# Altium schematic sheet theremin.SchDoc
size Letter
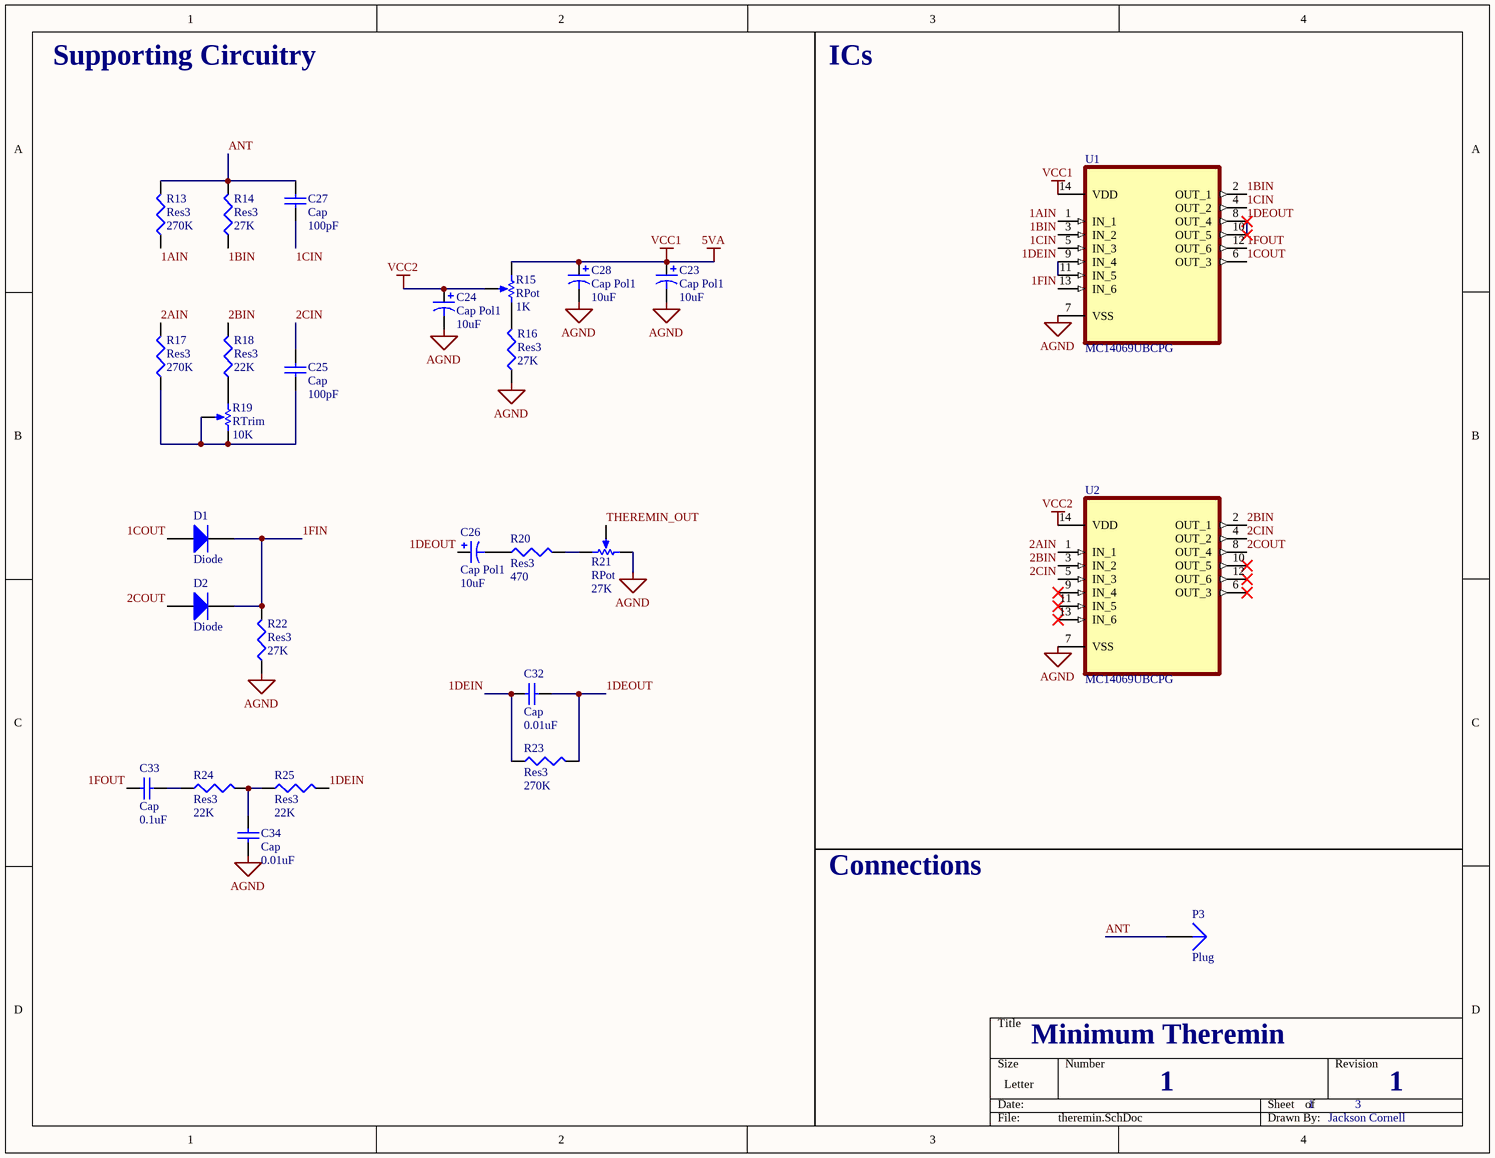
[diagram p0: theremin.SchDoc]

## Parts
C23  Cap Pol1  value 10uF  [CAPC0805]
C24  Cap Pol1  value 10uF  [CAPC0805]
C25  Cap  value 100pF  [CAPC0805]
C26  Cap Pol1  value 10uF  [CAPC0805]
C27  Cap  value 100pF  [CAPC0805]
C28  Cap Pol1  value 10uF  [CAPC0805]
C32  Cap  value 0.01uF  [CAPC0805]
C33  Cap  value 0.1uF  [CAPC0805]
C34  Cap  value 0.01uF  [CAPC0805]
D1  Diode  [SMC]
D2  Diode  [SMC]
P3  Plug  [PIN1]
R13  Res3  value 270K  [RES0805]
R14  Res3  value 27K  [RES0805]
R15  RPot  value 1K  [HDR1X3]
R16  Res3  value 27K  [RES0805]
R17  Res3  value 270K  [RES0805]
R18  Res3  value 22K  [RES0805]
R19  RTrim  value 10K  [VR5]
R20  Res3  value 470  [RES0805]
R21  RPot  value 27K  [HDR1X3]
R22  Res3  value 27K  [RES0805]
R23  Res3  value 270K  [RES0805]
R24  Res3  value 22K  [RES0805]
R25  Res3  value 22K  [RES0805]
U1  MC14069UBCPG  [DIP254P762X469-14]
U2  MC14069UBCPG  [DIP254P762X469-14]

## Nets
5VA: C23.1 C28.1 R15.1(TOP) U1.14(VDD)  [also labelled VCC1]
AGND: C23.2 C24.2 C28.2 C34.1 R16.1 R21.1(TOP) R22.1 U1.7(VSS) U2.7(VSS)
VCC2: C24.1 R15.3(TAP) U2.14(VDD)
1AIN: R13.1 U1.1(IN_1)
1BIN: R14.1 U1.2(OUT_1) U1.3(IN_2)
1CIN: C27.1 U1.4(OUT_2) U1.5(IN_3)
1COUT: D1.1(A) U1.6(OUT_3)
1DEIN: C32.1 R23.1 R25.2 U1.9(IN_4) U1.11(IN_5)
1DEOUT: C26.1 C32.2 R23.2 U1.8(OUT_4) U1.10(OUT_5)
1FIN: D1.2(K) D2.2(K) R22.2 U1.13(IN_6)
1FOUT: C33.1 U1.12(OUT_6)
2AIN: R17.2 U2.1(IN_1)
2BIN: R18.2 U2.2(OUT_1) U2.3(IN_2)
2CIN: C25.2 U2.4(OUT_2) U2.5(IN_3)
2COUT: D2.1(A) U2.8(OUT_4)
ANT: C27.2 P3.1 R13.2 R14.2
THEREMIN_OUT: R21.3(TAP)
NetC25_1: C25.1 R17.1 R19.2(BOT) R19.3(TAP)
NetC26_2: C26.2 R20.1
NetC33_2: C33.2 R24.1
NetC34_2: C34.2 R24.2 R25.1
NetR15_2: R15.2(BOT) R16.2
NetR18_1: R18.1 R19.1(TOP)
NetR20_2: R20.2 R21.2(BOT)

Not connected (* = marked no-connect by the designer): U2 6(OUT_3)* 9(IN_4)* 10(OUT_5)* 11(IN_5)* 12(OUT_6)* 13(IN_6)*

## Notes on the sheet
- Supporting Circuitry
- ICs
- Connections
- Minimum Theremin
- 1
- 3
- Jackson Cornell

## Library data of the parts
C23 C24 C26 C28 = Cap Pol1: Polarized Capacitor (Radial); Published: 8-Jun-2000; LatestRevisionDate: 17-Jul-2002; LatestRevisionNote: Re-released for DXP Platform.; PackageReference: RB7.6-15; Publisher: Altium Limited; PackageDescription: Polarized Capacitor (Radial); 2 Leads
C25 C27 C32-C34 = Cap: Capacitor; Published: 8-Jun-2000; LatestRevisionDate: 17-Jul-2002; LatestRevisionNote: Re-released for DXP Platform.; PackageReference: RAD-0.3; Publisher: Altium Limited; PackageDescription: Radial Cap, Thru-Hole; 2 Leads; 0.3 in Pin Spacing
D1 D2 = Diode: Default Diode; Published: 8-Jun-2000; LatestRevisionDate: 17-Jul-2002; LatestRevisionNote: Re-released for DXP Platform.; PackageVersion: Sep-1996; PackageReference: SMC; Publisher: Altium Limited; PackageDescription: DO-214-AB/SMC; 2 C-Bend Leads; Body 7.9 x 5.9 mm, inc. leads (LxW); Code_JEDEC: DO-214-AB
R13 R14 R16-R18 R20 R22-R25 = Res3: Resistor; Published: 8-Jun-2000; LatestRevisionDate: 29-May-2009; LatestRevisionNote: IPC-7351 Footprint Added.; PackageReference: J1-0603; Publisher: Altium Limited; PackageDescription: Chip Resistor
R15 R19 R21 = RPot: Potentiometer; Sim Note: Enter the Resistance value and the set point into parameter fields.; Set Position: 0.5; Published: 8-Jun-2000; LatestRevisionDate: 17-Jul-2002; LatestRevisionNote: Re-released for DXP Platform.; PackageReference: VR5; Publisher: Altium Limited; PackageDescription: Variable Resistor, Thru-Hole; 3 Leads
U1 U2 = MC14069UBCPG: Inverter IC 6 Channel - 14-PDIP; MF: ON Semiconductor; Price: None; Value: *; Package: DIP-14 Motorola; SnapEDA_Link: https://www.snapeda.com/parts/MC14069UBCPG/Onsemi/view-part/?ref=snap; Check_prices: https://www.snapeda.com/parts/MC14069UBCPG/Onsemi/view-part/?ref=eda; Availability: In Stock; MP: MC14069UBCPG
P3 = Plug: LatestRevisionDate: 17-Jul-2002; LatestRevisionNote: Re-released for DXP Platform.; Publisher: Altium Limited